# EAGLE design ADXL316-module (EAGLE 9.5.1)
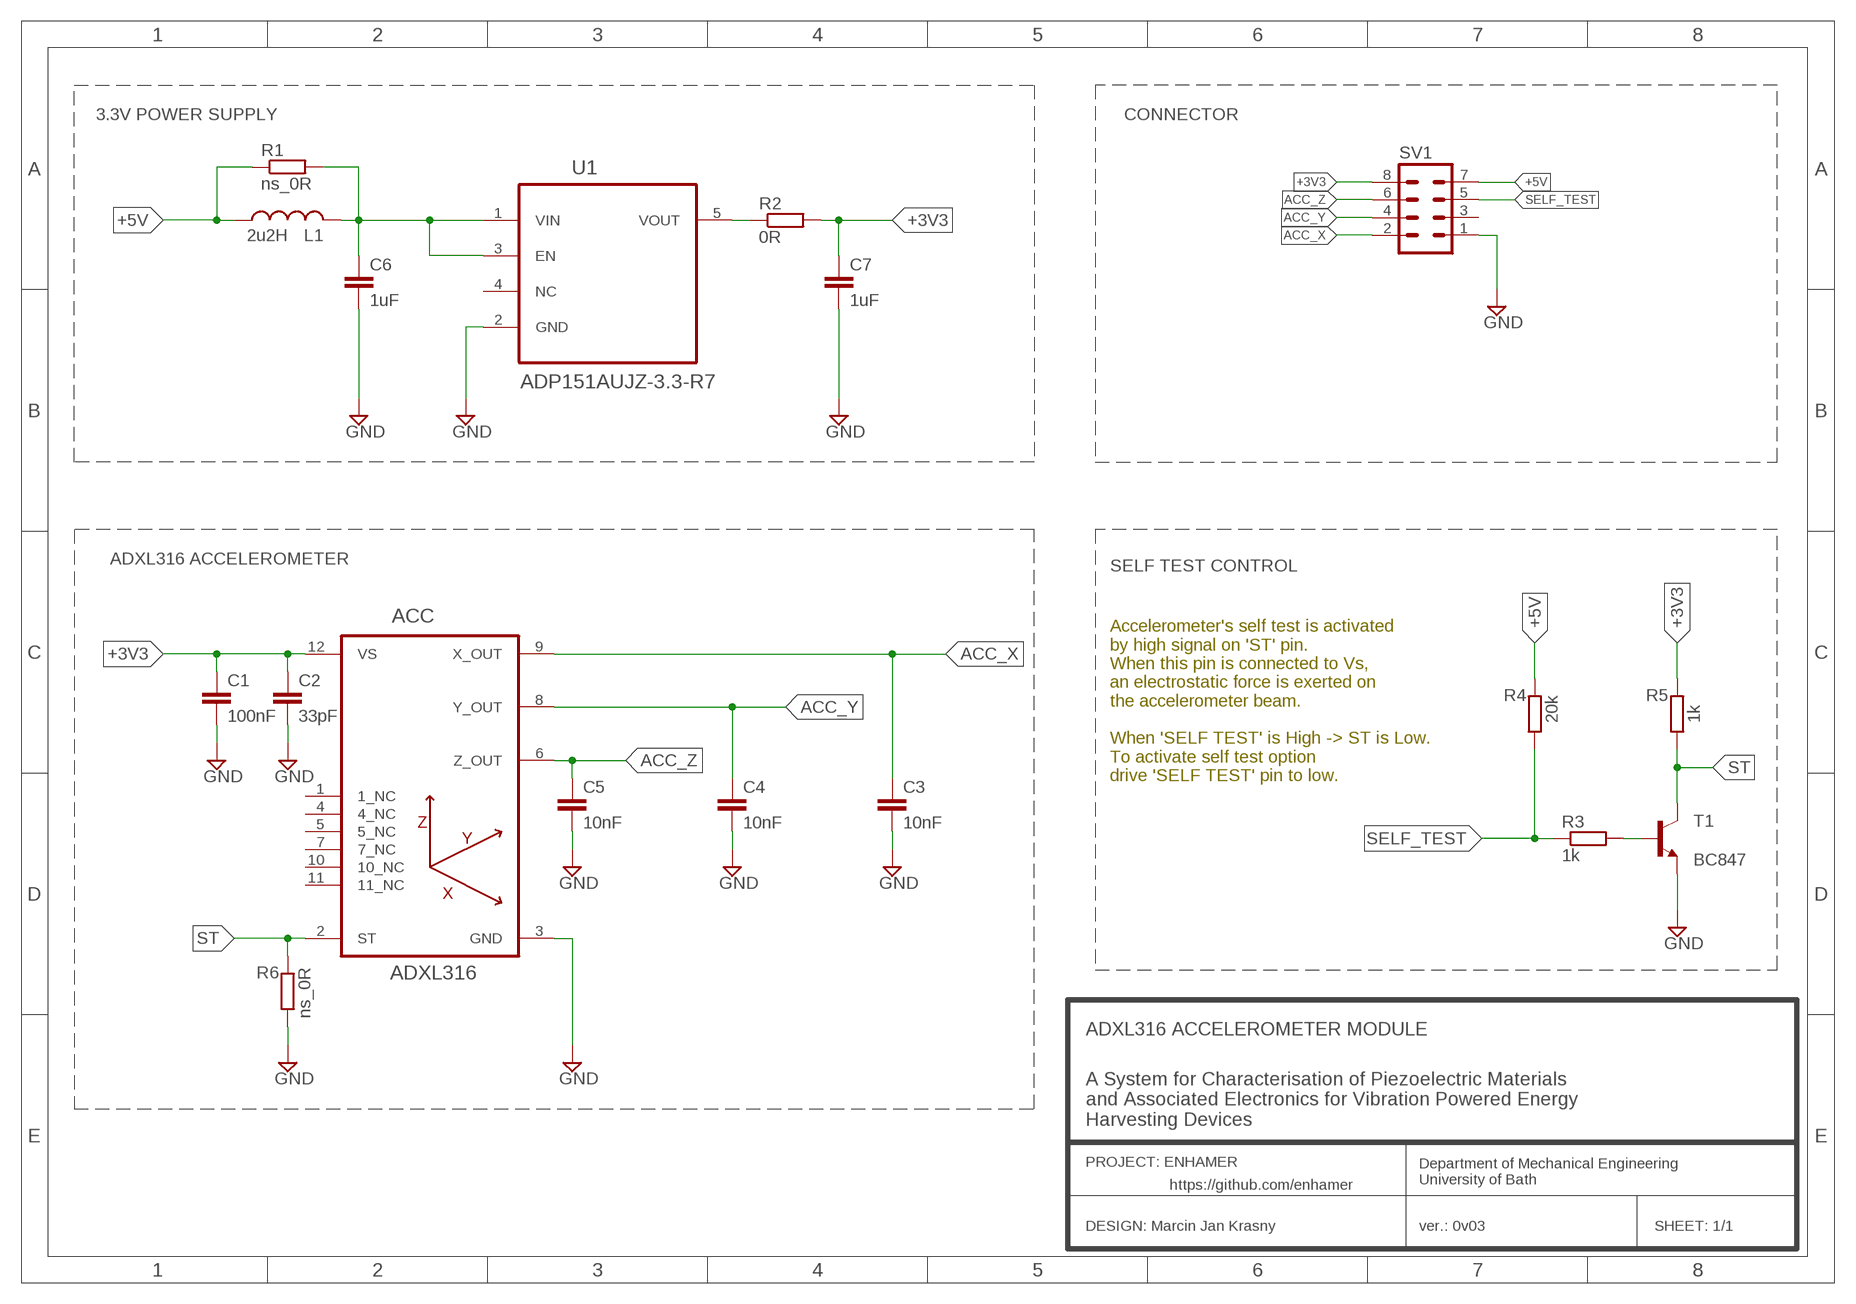
[diagram p0: schematic, sheet 1]

## Parts
ACC  ADXL316  ADXL316_MJK  [QFN24-4X4_MJK]
C1  100nF  C0805  [0805]
C2  33pF  C0805  [0805]
C3  10nF  C0805  [0805]
C4  10nF  C0805  [0805]
C5  10nF  C0805  [0805]
C6  1uF  C0805  [0805]
C7  1uF  C0805  [0805]
L1  2u2H  L0805_[2016_METRIC]  [0805]
R1  ns_0R  R0805  [0805]
R2  0R  R0805  [0805]
R3  1k  R0805  [0805]
R4  20k  R0805  [0805]
R5  1k  R0805  [0805]
R6  ns_0R  R0805  [0805]
SV1  MA04-2  [MA04-2]
T1  BC847  [SOT23]
U1  ADP151AUJZ-3.3-R7  [SOT95P280X100-5N]

## Nets
+3V3: ACC.12(VS) C1.1 C2.1 C7.1 R2.2 R5.2 SV1.8
+5V: L1.1 R1.1 R4.2 SV1.7
ACC_X: ACC.9(X_OUT) C3.1 SV1.2
ACC_Y: ACC.8(Y_OUT) C4.1 SV1.4
ACC_Z: ACC.6(Z_OUT) C5.1 SV1.6
GND: ACC.3(GND) C1.2 C2.2 C3.2 C4.2 C5.2 C6.2 C7.2 R6.1 SV1.1 T1.2(E) U1.2(GND)
N$4: C6.1 L1.2 R1.2 U1.1(VIN) U1.3(EN)
N$5: R2.1 U1.5(VOUT)
N$53: R3.2 T1.1(B)
SELF_TEST: R3.1 R4.1 SV1.5
ST: ACC.2(ST) R5.1 R6.2 T1.3(C)
Unconnected: ACC.1(1_NC) ACC.4(4_NC) ACC.5(5_NC) ACC.7(7_NC) ACC.10(10_NC) ACC.11(11_NC) SV1.3 U1.4(NC)

## Notes on the sheet
- 3.3V POWER SUPPLY | CONNECTOR
- ADXL316 ACCELEROMETER
- SELF TEST CONTROL
- Accelerometer's self test is activated 
  by high signal on 'ST' pin.
  When this pin is connected to Vs, 
  an electrostatic force is exerted on 
  the accelerometer beam.
  
  When 'SELF TEST' is High -> ST is Low.
  To activate self test option
  drive 'SELF TEST' pin to low.
- ADXL316 ACCELEROMETER MODULE
- A System for Characterisation of Piezoelectric Materials 
  and Associated Electronics for Vibration Powered Energy 
  Harvesting Devices
- PROJECT: ENHAMER
- Department of Mechanical Engineering
  University of Bath
- https://github.com/enhamer
- DESIGN: Marcin Jan Krasny | ver.: 0v03 | SHEET: 1/1

## Library data of the parts
ACC = _Accelerometers_Krasny:ADXL316_MJK: The ADXL316 is a complete 3-axis acceleration measurement system ADXL316 Datasheet <http://www.analog.com/media/en/technical-documentation/data-sheets/ADXL316.pdf> Measurement range of ±16 g minimum The output signals are analog voltages that are proportional to acceleration The user sets the signal bandwidth of the device by adding a capacitor. This filtering improves measurement resolution and helps prevent aliasing. Bandwidth = 1/(2 × π × 32 kΩ × C). For CX, CY = 0.003 μF, the bandwidth = 1.6 kHz. For CZ = 0.01 μF, the bandwidth = 500 Hz. For CX, CY, and CZ = 10 μF, the bandwidth = 0.5 Hz.
C1-C7 = _passive_Krasny:C: CAPACITOR, European symbol
L1 = _passive_Krasny:L: INDUCTOR
R1-R6 = _passive_Krasny:R: RESISTOR, European symbol
SV1 = con-lstb:MA04-2: PIN HEADER; OC_FARNELL: unknown; OC_NEWARK: unknown
T1 = transistor:BC847: NPN TRANSISTOR
U1 = _PowerSupply_Krasny:ADP151AUJZ-3.3-R7: Ultralow Noise,200 mA, CMOS Linear Regulator; MPN: ADP151AUJZ-3.3-R7; OC_FARNELL: 2074871; OC_NEWARK: 67W2692; PACKAGE: TSOT-5; SUPPLIER: Analog Devices

## Net classes
0 default: width 0.203 mm, drill 0.305 mm, clearance 0.203 mm

## Board
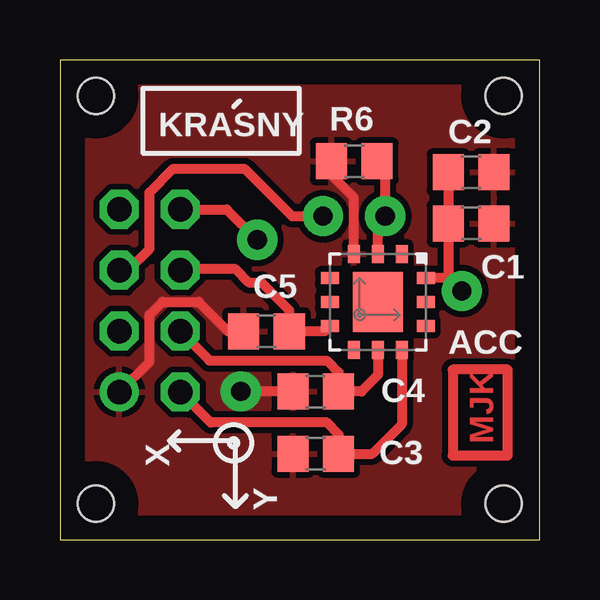
[diagram p1: board, top side]
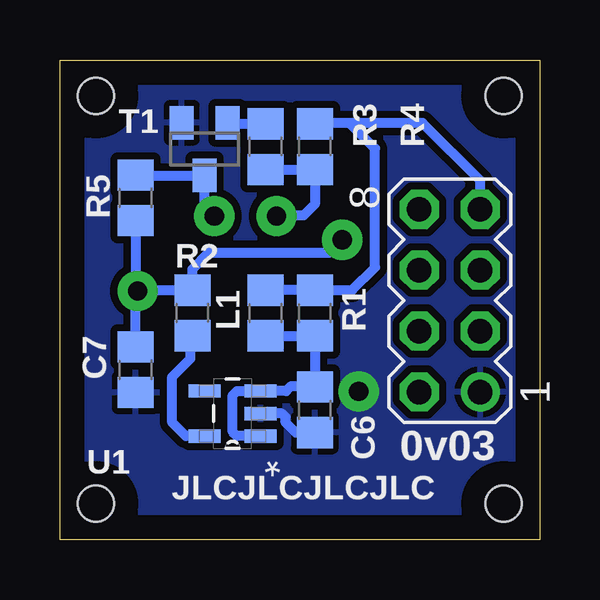
[diagram p2: board, bottom side, seen from below]

Size 20 x 20 mm. Coordinates in mm from the lower left corner, seen from the top.
Outline: 0,0 20,0 20,20 0,20 0,0
Copper layers (1*16): Top 0.035mm / dielectric 1.5mm / Bottom 0.035mm
Design rules "JLCPCB_ver001": minimum track width 6mil, minimum drill 0.35mm, track to track 6mil, track to pad 6mil, pad to pad 6mil, via to via 6mil, smd to smd 6mil, copper to edge 40mil, drill to drill 6mil, minimum pad ring 12mil, minimum via ring 10mil, stop-mask expansion 6mil, vias tented up to drill 0mil, thermal gap 10mil
Holes 1.5 mm at 1.5,1.5 18.5,1.5 18.5,18.5 1.5,18.5

### Footprints (pad centres in the part's own frame; a part is rotated, then mirrored left to right if it is on the bottom)
QFN24-4X4_MJK = smd 0.75 x 0.5: 1 -2,1; 2 -2,0; 3 -2,-1; 7 2,-1; 8 2,0; 9 2,1 | smd 0.5 x 0.75: 4 -1,-2; 5 0,-2; 6 1,-2; 10 1,2; 11 0,2; 12 -1,2 | smd 2.5 x 2.1: EXP 0,0
0805 = smd 1.3 x 1.5: 1 -0.95,0; 2 0.95,0
MA04-2 = drill 1.016: 1 -3.81,-1.27 | drill 1.016 octagon: 2 -3.81,1.27; 3 -1.27,-1.27; 4 -1.27,1.27; 5 1.27,-1.27; 6 1.27,1.27; 7 3.81,-1.27; 8 3.81,1.27
SOT23 = smd 1 x 1.4: 1 -0.95,-1.1; 2 0.95,-1.1; 3 0,1.1
SOT95P280X100-5N = smd 1.321 x 0.559: 1 -1.168,0.94; 2 -1.168,0; 3 -1.168,-0.94; 4 1.168,-0.94; 5 1.168,0.94

### Placement (x,y rotation side)
ACC  13.26,9.91 270 top
C1  17.14,13.18 0 top
C2  17.14,15.32 0 top
C3  10.67,3.58 180 top
C4  10.67,6.17 180 top
C5  8.61,8.69 180 top
C6  9.37,5.41 270 bottom
C7  16.84,7.09 270 bottom
L1  11.43,9.45 270 bottom
R1  9.37,9.45 270 bottom
R2  14.48,9.45 90 bottom
R3  11.43,16.38 90 bottom
R4  9.37,16.38 90 bottom
R5  16.84,14.25 270 bottom
R6  12.27,15.77 0 top
SV1  3.75,9.96 90 bottom
T1  13.97,16.28 180 bottom
U1  12.8,5.26 180 bottom

### Tracks (layer width: path | path; a pad name or v marks a point on that pad's centre or on a via)
+3V3  (via drill 0.8 pad 1.68)
  Top 0.406: C2.1 C1.1 16.2,10.93 16.22,10.91 | 16.22,10.91 ACC.12 | 16.22,10.91 v16.76,10.36 | SV1.8 6.96,13.77 v8.23,12.5
  Bottom 0.406: v16.76,10.36 16.73,10.4 R2.2 14.48,11.28 13.79,11.96 8.76,11.96 v8.23,12.5 | C7.1 16.84,10.29 v16.76,10.36 | R5.2 16.84,10.44 v16.76,10.36
+5V
  Bottom 0.406: L1.1 R1.1 7.81,10.4 6.86,11.35 6.86,16.31 7.92,17.37 | SV1.7 2.48,14.97 4.88,17.37 7.92,17.37 | 7.92,17.37 9.33,17.37 R4.2
ACC_X
  Top 0.406: ACC.9 14.26,4.81 13.03,3.58 C3.1 11.62,4.38 11.12,4.88 6.29,4.88 SV1.2
ACC_Y
  Top 0.406: ACC.8 13.26,6.86 12.57,6.17 C4.1 11.62,6.97 11.12,7.47 6.24,7.47 SV1.4
ACC_Z
  Top 0.406: SV1.6 5.06,11.28 7.32,11.28 7.87,10.72 8.4,10.72 9.56,9.57 C5.1 11.04,8.69 ACC.6
GND  (via drill 0.8 pad 1.68)
  Top 0.406: C4.2 v7.54,6.17 | ACC.3 12.26,14.26 11.43,15.09 11.43,15.66 R6.1 | C5.2 7.01,8.69 5.79,9.91 4.27,9.91 3.73,9.37 3.73,7.41 SV1.1
  Bottom 0.406: C6.2 10.18,4.46 10.59,4.88 10.59,5.11 10.74,5.26 U1.2
  pour Bottom (isolate 0.305): 0,0 20.04,0 19.96,19.96 0,19.96
  pour Top (isolate 0.254): 20.04,0 0,0 0.08,19.96 20.04,19.96
N$1
  Top 0.406: 16.38,3.5 18.67,3.5 18.67,7.09 16.38,7.09 16.38,3.5
N$4
  Bottom 0.406: L1.2 R1.2 C6.1 9.41,6.4 10.36,6.4 10.57,6.2 U1.3 12.62,6.2 12.8,6.02 12.8,4.5 12.62,4.32 U1.1
N$5
  Bottom 0.406: U1.5 14.76,4.32 15.32,4.88 15.32,6.78 14.55,7.54 14.55,8.42 R2.1
N$53
  Bottom 0.406: R3.2 12.97,17.33 T1.1
SELF_TEST  (via drill 0.8 pad 1.68)
  Top 0.406: v10.97,13.49 9.68,13.49 7.7,15.47 4.72,15.47 3.73,14.48 3.73,12.12 2.85,11.23 SV1.5
  Bottom 0.406: R3.1 R4.1 9.37,13.98 9.83,13.53 10.93,13.53 v10.97,13.49
ST  (via drill 0.8 pad 1.68)
  Top 0.406: ACC.2 13.26,13.18 v13.56,13.49 13.56,15.43 R6.2
  Bottom 0.406: v13.56,13.49 13.97,13.89 T1.3 16.82,15.18 R5.1

### Text on the board
Top: MJK
tPlace: KRASNY | X | Y
bPlace: 0v03 | JLCJLCJLCJLC
Document: NOTES: | 1. THE FOLLOWING INFORMATION APPLIES TO THIS BOARD: | # PCB: FR-4 EPOXY LAMINATE | # 2 COPPER LAYERS | # COPPER PLATING: 1 oz (34.79 µm) | # BOARD THICKNESS: 1.6 mm | 2. MOUNTING HOLES SPACING: 17 mm | 3. BOARD DIMENSION: 20 x 20 [mm] | 4. LAYOUT GRID: 3 mils (0.0762mm)
Title_block: ADXL316 ACCELEROMETER MODULE | A System for Characterisation of Piezoelectric Materials / and Associated Electronics for Vibration Powered Energy / Harvesting Devices | PROJECT: ENHAMER | Department of Mechanical Engineering / University of Bath | https://github.com/enhamer | DESIGN: Marcin Jan Krasny | ver.: 0v03 | SHEET: 1/1